# Altium schematic sheet MVM_BMS.SchDoc: Title
size 420 x 297 mm; Author: G.Kasprowicz; CompanyName: WUT ISE; DrawnBy: G.Kasprowicz; Organization: WUT ISE; Address1: PW ISE; Address2: Nowowiejska 15/19 00-665 Warsaw; Address3: gkasprow@gmail.com; Revision: 2; SheetNumber: 3; SheetTotal: 5; ModifiedBy: -; CheckedDate: -; Title2: Title 2; DivGrp: WUT ISE; Designer: G.Kasprowicz; ModifiedDate: -; ProjectName: Sensor Box
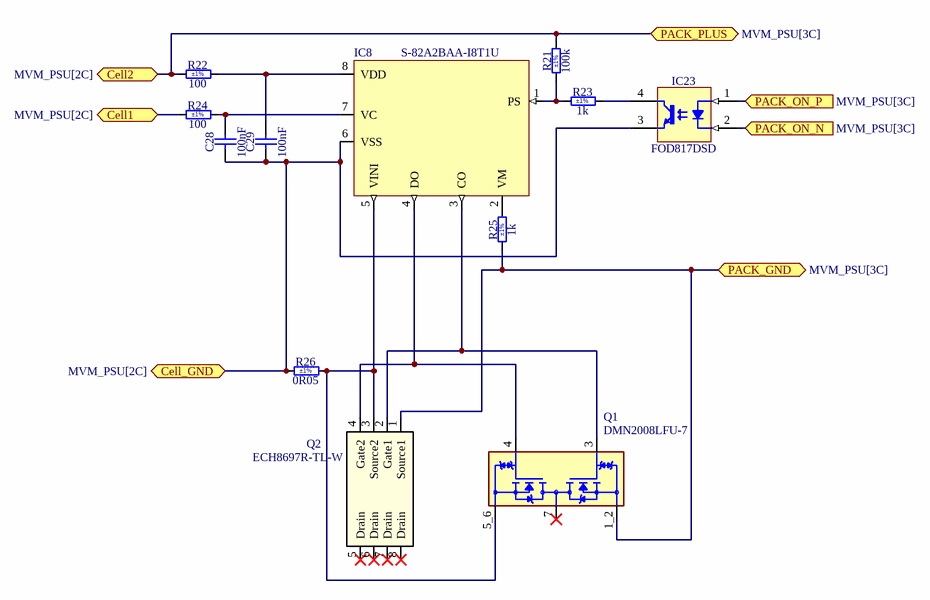
[diagram p0: MVM_BMS.SchDoc]

## Parts
C28  100nF  [CAPC2012X88N]
C29  100nF  [CAPC2012X88N]
IC8  S-82A2BAA-I8T1U  [SON50P200X48-8N]
IC23  FOD817DSD  [FAIRCHILD_FOD817DSD]
Q1  DMN2008LFU-7  [TRANS_DMN2008LFU-7]
Q2  ECH8697R-TL-W  [SOT-28FL-8_2P9X2P3_ONS-M]
R21  100k  Tolerance: ±1%  [RESC1608X55N]
R22  100  Tolerance: ±1%  [RESC1608X55N]
R23  1k  Tolerance: ±1%  [RESC1608X55N]
R24  100  Tolerance: ±1%  [RESC1608X55N]
R25  1k  Tolerance: ±1%  [RESC1608X55N]
R26  0R05  Tolerance: ±1%  [RESC2012X60N]

## Ports
Cell1 (bidir, see MVM_PSU[2C]), Cell2 (bidir, see MVM_PSU[2C]), Cell_GND (bidir, see MVM_PSU[2C]), PACK_GND (bidir, see MVM_PSU[3C]), PACK_ON_N (in, see MVM_PSU[3C]), PACK_ON_P (in, see MVM_PSU[3C]), PACK_PLUS (bidir, see MVM_PSU[3C])

## Nets
Cell1: R24.1 ; port Cell1
Cell2: R21.2 R22.1 ; port Cell2, port PACK_PLUS
Cell_GND: C28.1 C29.1 IC8.6(VSS) IC23.3(E) R26.1 ; port Cell_GND
PACK_GND: Q1.1_2(S1) Q2.1(Source1) R25.1 ; port PACK_GND
PACK_ON_N: IC23.2(C) ; port PACK_ON_N
PACK_ON_P: IC23.1(A) ; port PACK_ON_P
NetC28_2: C28.2 IC8.7(VC) R24.2
NetC29_2: C29.2 IC8.8(VDD) R22.2
NetIC8_1: IC8.1(PS) R21.1 R23.1
NetIC8_2: IC8.2(VM) R25.2
NetIC8_3: IC8.3(CO) Q1.3(G1) Q2.2(Gate1)
NetIC8_4: IC8.4(DO) Q1.4(G2) Q2.4(Gate2)
NetIC8_5: IC8.5(VINI) Q1.5_6(S2) Q2.3(Source2) R26.2
NetIC23_4: IC23.4(C) R23.2

Not connected (* = marked no-connect by the designer): Q1 7(D)*; Q2 5(Drain)* 6(Drain)* 7(Drain)* 8(Drain)*

## Notes on the sheet
- Project/Equipment
- Document
- Designer
- Drawn by
- Check.by
- Copyright WUT ISE 2024.
  This documentation describes Open Hardware and is licensed under the CERN OHL v.2. You may redistribute and modify this documentation under the terms of the CERN OHL v.2. (http://ohwr.org/CERNOHL). This documentation is distributed WITHOUT ANY EXPRESS OR IMPLIED WARRANTY, INCLUDING OF MERCHANTABILITY, SATISFACTORY QUALITY AND FITNESS FOR A PARTICULAR PURPOSE. Please see the CERN OHL v.2 for applicable conditions.
- Contact
- File
- Last Mod.
- Print Date
- Sheet
- Size
- A3
- of
- Rev

## Library data of the parts
C28 C29 = CC0805_100NF_50V_1%_NP0: Non-polarised capacitor; Part Description: SMD Multilayer Chip Ceramic Capacitor; Manufacturer: GENERIC; Manufacturer1 Part Number: 0805N103F500C; Voltage: 50V; TC: C0G/NP0; Tolerance: ±1%; Part Number: CC0805_100NF_50V_1%_NP0; Component Kind: Standard; Component Type: Standard; Footprint: CAPC2012X135N; Pin Count: 2; Value: 100nF; Status: Not Recommended; Manufacturer Part Number: CC0805_100NF_50V_1%_NP0; Case: 0805; Mounted: Yes; Socket: No; SMD: Yes; Sense: No; ComponentHeight: 1.35mm; Manufacturer1 Example: WALSIN TECHNOLOGY CORPORATION; Manufacturer1 ComponentHeight: 1.35mm; HelpURL: \\cern.ch\dfs\Applications\Altium\Datasheets\CC0805_WALSIN_0805.pdf; Author: CERN DEM HF; CreateDate: 28.08.2023; LatestRevisionDate: 28.08.2023
IC8 = PM_S-82A2BAA-I8T1U: BATTERY PROTECTION IC / FOR 2-SERIAL-CELL PACK; Manufacturer: ABLIC; Manufacturer Part Number: S-82A2BAA-I8T1U
IC23 = FOD817DSD: Single Optocoupler; Part Description: 4-Pin High Operating Temperature Phototransistor Optocoupler; Manufacturer: FAIRCHILD SEMICONDUCTOR; PressFit: No; Bonding: No; Part Number: FOD817DSD; Component Kind: Standard; Component Type: Standard; Device: FOD817DSD; PackageDescription: SOIC, 2.54mm Pitch; 4 Pin, 6.50mm W X 4.60mm L X 4.60mm H body; Manufacturer Part Number: FOD817DSD; Pin Count: 4; Case: SOIC4; Mounted: Yes; Socket: No; SMD: Yes; Sense: No; ComponentHeight: 4.6mm; HelpURL: \\cern.ch\dfs\Applications\Altium\Datasheets\FOD817DSD.pdf; Author: CERN DEM JLC; CreateDate: 21.07.2014; LatestRevisionDate: 21.07.2014
Q1 = Q_DMN2008LFU-7: Mosfet Array 2 N-Channel (Dual) Common Drain 20V 14.5A 1W Surface Mount U-DFN2030-6 (Type B); MF: Diodes Inc.; Package: UFDFN-6 Diodes Inc.; Digi-Key_Part_Number: DMN2008LFU-7DICT-ND; Value: *; SnapEDA_Link: https://www.snapeda.com/parts/DMN2008LFU-7/Diodes%20Inc./view-part/612914/?ref=snap; Check_prices: https://www.snapeda.com/parts/DMN2008LFU-7/Diodes%20Inc./view-part/612914/?ref=eda; Purchase-URL: https://pricing.snapeda.com/search/part/DMN2008LFU-7/?ref=eda; MP: DMN2008LFU-7
Q2 = Q_ECH8697R-TL-W: No Description Available; Vendor: ON Semiconductor; Built_By: EMA_Molly; SourceLibrary: OnSemi_2021-05-28_2; Type: DEV; Manufacturer_Part_Number: ECH8697R-TL-W; Copyright: Copyright (C) 2018 Accelerated Designs. All rights reserved; RefDes: RefDes
R21 = R0603_100K_1%_0.1W_100PPM: Resistor - 1%; Part Description: General Purpose Thick Film Chip Resistor; Manufacturer: GENERIC; Manufacturer1 Part Number: NRC06F1003TRF; Power: 0.1W; TC: ±100ppm/°C; PressFit: No; Part Number: R0603_100K_1%_0.1W_100PPM; Component Kind: Standard; Component Type: Standard; Pin Count: 2; Value: 100k; Status: Preferred; Manufacturer Part Number: R0603_100K_1%_0.1W_100PPM; Case: 0603; Mounted: Yes; Sense: No; Socket: No; SMD: Yes; Manufacturer1 Example: NIC COMPONENT; Manufacturer1 ComponentHeight: 0.55mm; HelpURL: \\cern.ch\dfs\Applications\Altium\Datasheets\R0603_NIC_NRC.pdf; Author: CERN DEM JLC; CreateDate: 03.12.2007; LatestRevisionDate: 13.03.2008
R22 R24 = R0603_100R_1%_0.1W_100PPM: Resistor - 1%; Part Description: General Purpose Thick Film Chip Resistor; Manufacturer: GENERIC; Manufacturer1 Part Number: NRC06F4700TRF; Power: 0.1W; TC: ±100ppm/°C; PressFit: No; Part Number: R0603_100R_1%_0.1W_100PPM; Component Kind: Standard; Component Type: Standard; Pin Count: 2; Value: 100; Status: Preferred; Manufacturer Part Number: R0603_100R_1%_0.1W_100PPM; Case: 0603; Mounted: Yes; Sense: No; Socket: No; SMD: Yes; Manufacturer1 Example: NIC COMPONENT; Manufacturer1 ComponentHeight: 0.55mm; HelpURL: \\cern.ch\dfs\Applications\Altium\Datasheets\R0603_NIC_NRC.pdf; Author: CERN DEM JLC; CreateDate: 03.12.2007; LatestRevisionDate: 13.03.2008
R23 R25 = R0603_1K_1%_0.1W_100PPM: Resistor - 1%; Part Description: General Purpose Thick Film Chip Resistor; Manufacturer: GENERIC; Manufacturer1 Part Number: NRC06F1001TRF; Power: 0.1W; TC: ±100ppm/°C; PressFit: No; Part Number: R0603_1K_1%_0.1W_100PPM; Component Kind: Standard; Component Type: Standard; Pin Count: 2; Value: 1k; Status: Preferred; Manufacturer Part Number: R0603_1K_1%_0.1W_100PPM; Case: 0603; Mounted: Yes; Sense: No; Socket: No; SMD: Yes; Manufacturer1 Example: NIC COMPONENT; Manufacturer1 ComponentHeight: 0.55mm; HelpURL: \\cern.ch\dfs\Applications\Altium\Datasheets\R0603_NIC_NRC.pdf; Author: CERN DEM JLC; CreateDate: 03.12.2007; LatestRevisionDate: 13.03.2008
R26 = R0805_0R05_1%_0.25W_300PPM: Resistor - 1%; Part Description: Low Resistance Thick Film Chip Resistor; Manufacturer: GENERIC; Manufacturer1 Part Number: 235051117500L or RL0805FR-7W0R05L; Power: 0.25W; TC: ±300ppm/°C; PressFit: No; Part Number: R0805_0R05_1%_0.25W_300PPM; Component Kind: Standard; Component Type: Standard; Pin Count: 2; Value: 0R05; Status: Not Recommended; Manufacturer Part Number: R0805_0R05_1%_0.25W_300PPM; Case: 0805; Mounted: Yes; Sense: No; Socket: No; SMD: Yes; Manufacturer1 Example: YAGEO PHYCOMP; Manufacturer1 ComponentHeight: 0.60mm; HelpURL: \\cern.ch\dfs\Applications\Altium\Datasheets\R0805_Phycomp_RL0805.pdf; Author: CERN DEM MR; CreateDate: 31.03.2016; LatestRevisionDate: 31.03.2016